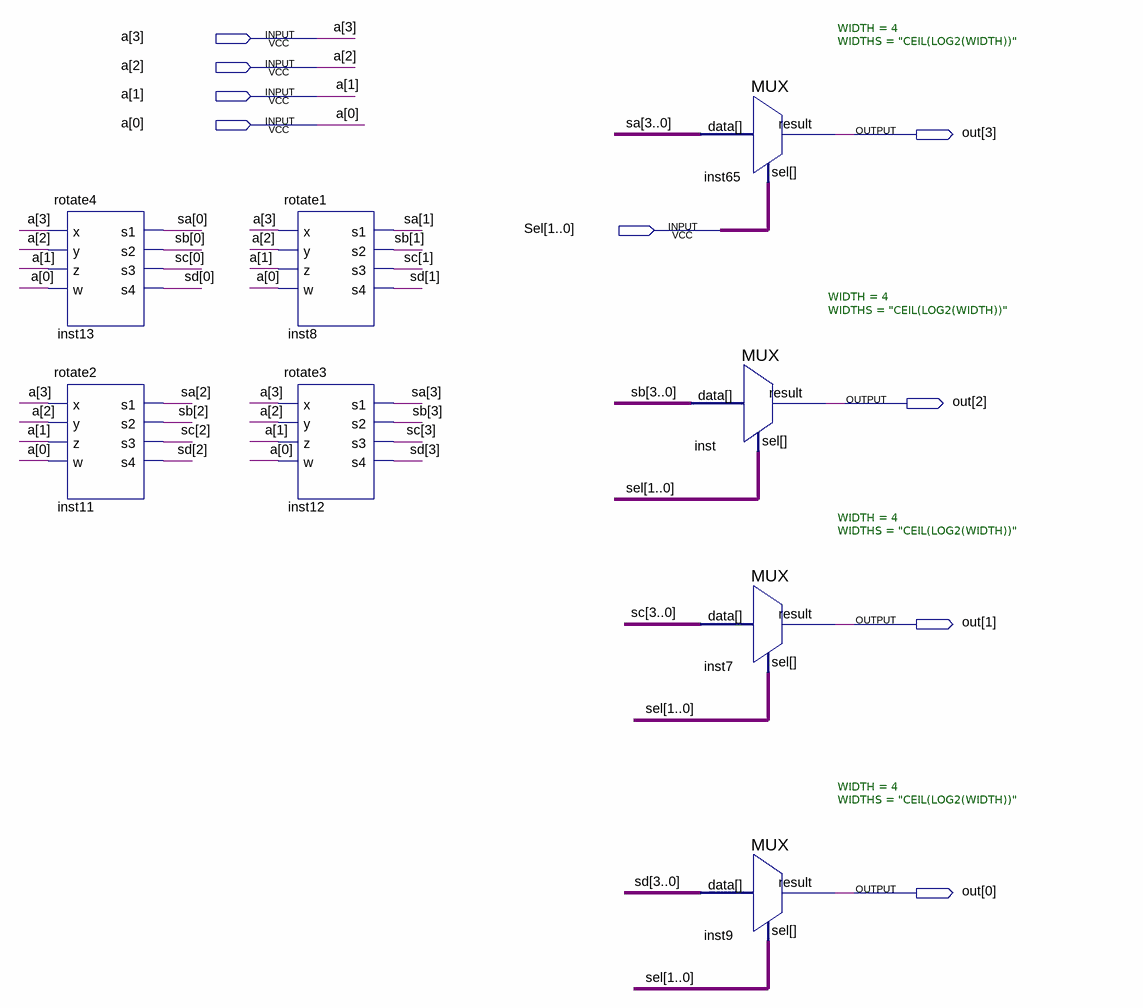
[diagram p0: schematic sheet]
// Quartus schematic rotateRight.bdf as structural Verilog: 8 symbols, 9 pins
module rotateRight (
  input  [3:0] a,
  input  [1:0] Sel,
  output [3:0] out
);

  wire [3:0] sa, sb, sc, sd;

  rotate4 inst13 (.x(a[3]), .y(a[2]), .z(a[1]), .w(a[0]), .s1(sa[0]), .s2(sb[0]), .s3(sc[0]), .s4(sd[0]));
  rotate2 inst11 (.x(a[3]), .y(a[2]), .z(a[1]), .w(a[0]), .s1(sa[2]), .s2(sb[2]), .s3(sc[2]), .s4(sd[2]));
  rotate1 inst8 (.x(a[3]), .y(a[2]), .z(a[1]), .w(a[0]), .s1(sa[1]), .s2(sb[1]), .s3(sc[1]), .s4(sd[1]));
  rotate3 inst12 (.x(a[3]), .y(a[2]), .z(a[1]), .w(a[0]), .s1(sa[3]), .s2(sb[3]), .s3(sc[3]), .s4(sd[3]));
  MUX #(.WIDTH(4), .WIDTHS("CEIL(LOG2(WIDTH))")) inst65 (.data(sa), .sel(Sel), .result(out[3]));
  MUX #(.WIDTH(4), .WIDTHS("CEIL(LOG2(WIDTH))")) inst (.data(sb), .sel(Sel), .result(out[2]));
  MUX #(.WIDTH(4), .WIDTHS("CEIL(LOG2(WIDTH))")) inst7 (.data(sc), .sel(Sel), .result(out[1]));
  MUX #(.WIDTH(4), .WIDTHS("CEIL(LOG2(WIDTH))")) inst9 (.data(sd), .sel(Sel), .result(out[0]));
endmodule
